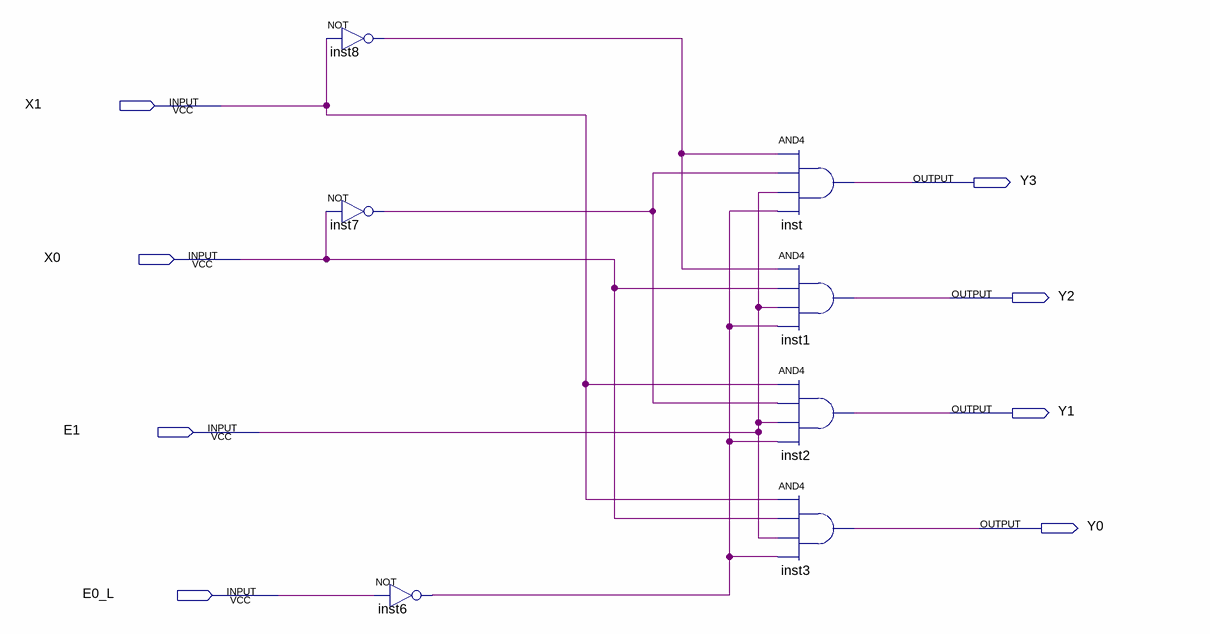
[diagram p0: schematic sheet]
// Quartus schematic Dec2_4.bdf as structural Verilog: 7 symbols, 8 pins
module Dec2_4 (
  input  X1,
  input  X0,
  input  E1,
  input  E0_L,
  output Y3,
  output Y2,
  output Y1,
  output Y0
);

  wire inst6_out, inst7_out, inst8_out;

  not inst8 (inst8_out, X1);
  not inst7 (inst7_out, X0);
  not inst6 (inst6_out, E0_L);
  and inst (Y3, inst8_out, inst7_out, E1, inst6_out);
  and inst1 (Y2, inst8_out, X0, E1, inst6_out);
  and inst2 (Y1, X1, inst7_out, E1, inst6_out);
  and inst3 (Y0, X1, X0, E1, inst6_out);
endmodule
